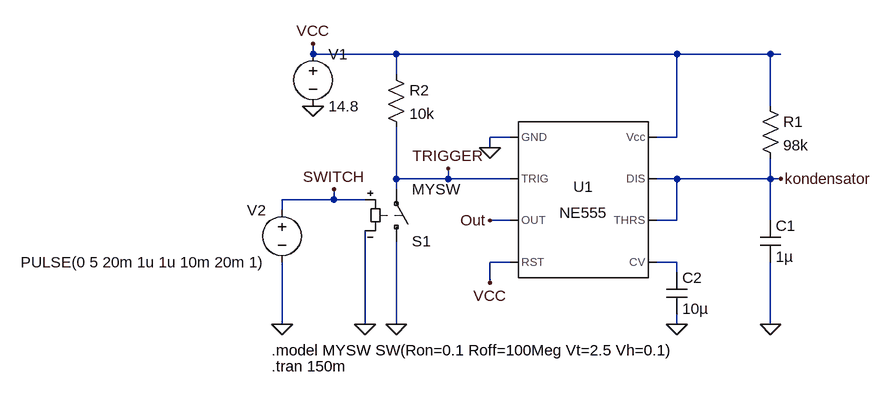
[diagram p0: schematic NE555_lista4.asc]
NE555_lista4.asc, the LTspice schematic file:
Version 4.1
SHEET 1 880 680
WIRE -208 -80 -208 -96
WIRE -80 -80 -208 -80
WIRE 352 -80 -80 -80
WIRE 496 -80 352 -80
WIRE 512 -80 496 -80
WIRE -80 -48 -80 -80
WIRE 496 0 496 -80
WIRE 96 48 64 48
WIRE 352 48 352 -80
WIRE 352 48 320 48
WIRE 64 64 64 48
WIRE -80 112 -80 32
WIRE 0 112 0 96
WIRE 0 112 -80 112
WIRE 96 112 0 112
WIRE 352 112 320 112
WIRE 496 112 496 80
WIRE 496 112 352 112
WIRE 512 112 496 112
WIRE -80 128 -80 112
WIRE -176 144 -176 128
WIRE -176 144 -256 144
WIRE -128 144 -176 144
WIRE -256 160 -256 144
WIRE 96 176 64 176
WIRE 352 176 352 112
WIRE 352 176 320 176
WIRE 496 176 496 112
WIRE 96 240 64 240
WIRE 352 240 320 240
WIRE 352 256 352 240
WIRE 64 272 64 240
WIRE -256 336 -256 240
WIRE -128 336 -128 192
WIRE -80 336 -80 208
WIRE 352 336 352 320
WIRE 496 336 496 240
FLAG -80 336 0
FLAG 496 336 0
FLAG 352 336 0
FLAG 64 64 0
FLAG -256 336 0
FLAG -128 336 0
FLAG 512 112 kondensator
FLAG 64 176 Out
FLAG -176 128 SWITCH
FLAG -208 0 0
FLAG 0 96 TRIGGER
FLAG -208 -96 VCC
FLAG 64 272 VCC
SYMBOL Misc\\NE555 208 144 R0
SYMATTR InstName U1
SYMBOL res 480 -16 R0
SYMATTR InstName R1
SYMATTR Value 98k
SYMBOL cap 480 176 R0
SYMATTR InstName C1
SYMATTR Value 1µ
SYMBOL res -96 -64 R0
SYMATTR InstName R2
SYMATTR Value 10k
SYMBOL voltage -208 -96 R0
WINDOW 123 0 0 Left 0
WINDOW 39 0 0 Left 0
SYMATTR InstName V1
SYMATTR Value 14.8
SYMBOL sw -80 224 M180
SYMATTR InstName S1
SYMATTR Value MYSW
SYMBOL cap 336 256 R0
SYMATTR InstName C2
SYMATTR Value 10µ
SYMBOL voltage -256 144 M0
WINDOW 123 0 0 Left 0
WINDOW 39 0 0 Left 0
SYMATTR InstName V2
SYMATTR Value PULSE(0 5 20m 1u 1u 10m 20m 1)
TEXT -272 376 Left 2 !.model MYSW SW(Ron=0.1 Roff=100Meg Vt=2.5 Vh=0.1)
TEXT -272 400 Left 2 !.tran 150m

The netlist it stands for:
* NE555_lista4.asc
X§U1 0 TRIGGER Out VCC N001 kondensator kondensator VCC NE555  ; pins GND TRIG OUT RST CV THRS DIS Vcc
R1 VCC kondensator 98k
C1 kondensator 0 1µ
R2 VCC TRIGGER 10k
V1 VCC 0 14.8
S1 0 TRIGGER SWITCH 0 MYSW
C2 N001 0 10µ
V2 SWITCH 0 PULSE(0 5 20m 1u 1u 10m 20m 1)
.model MYSW SW(Ron=0.1 Roff=100Meg Vt=2.5 Vh=0.1)
.tran 150m
.lib NE555.sub
.backanno
.end